# Altium project RPM_Chap.PrjPcb
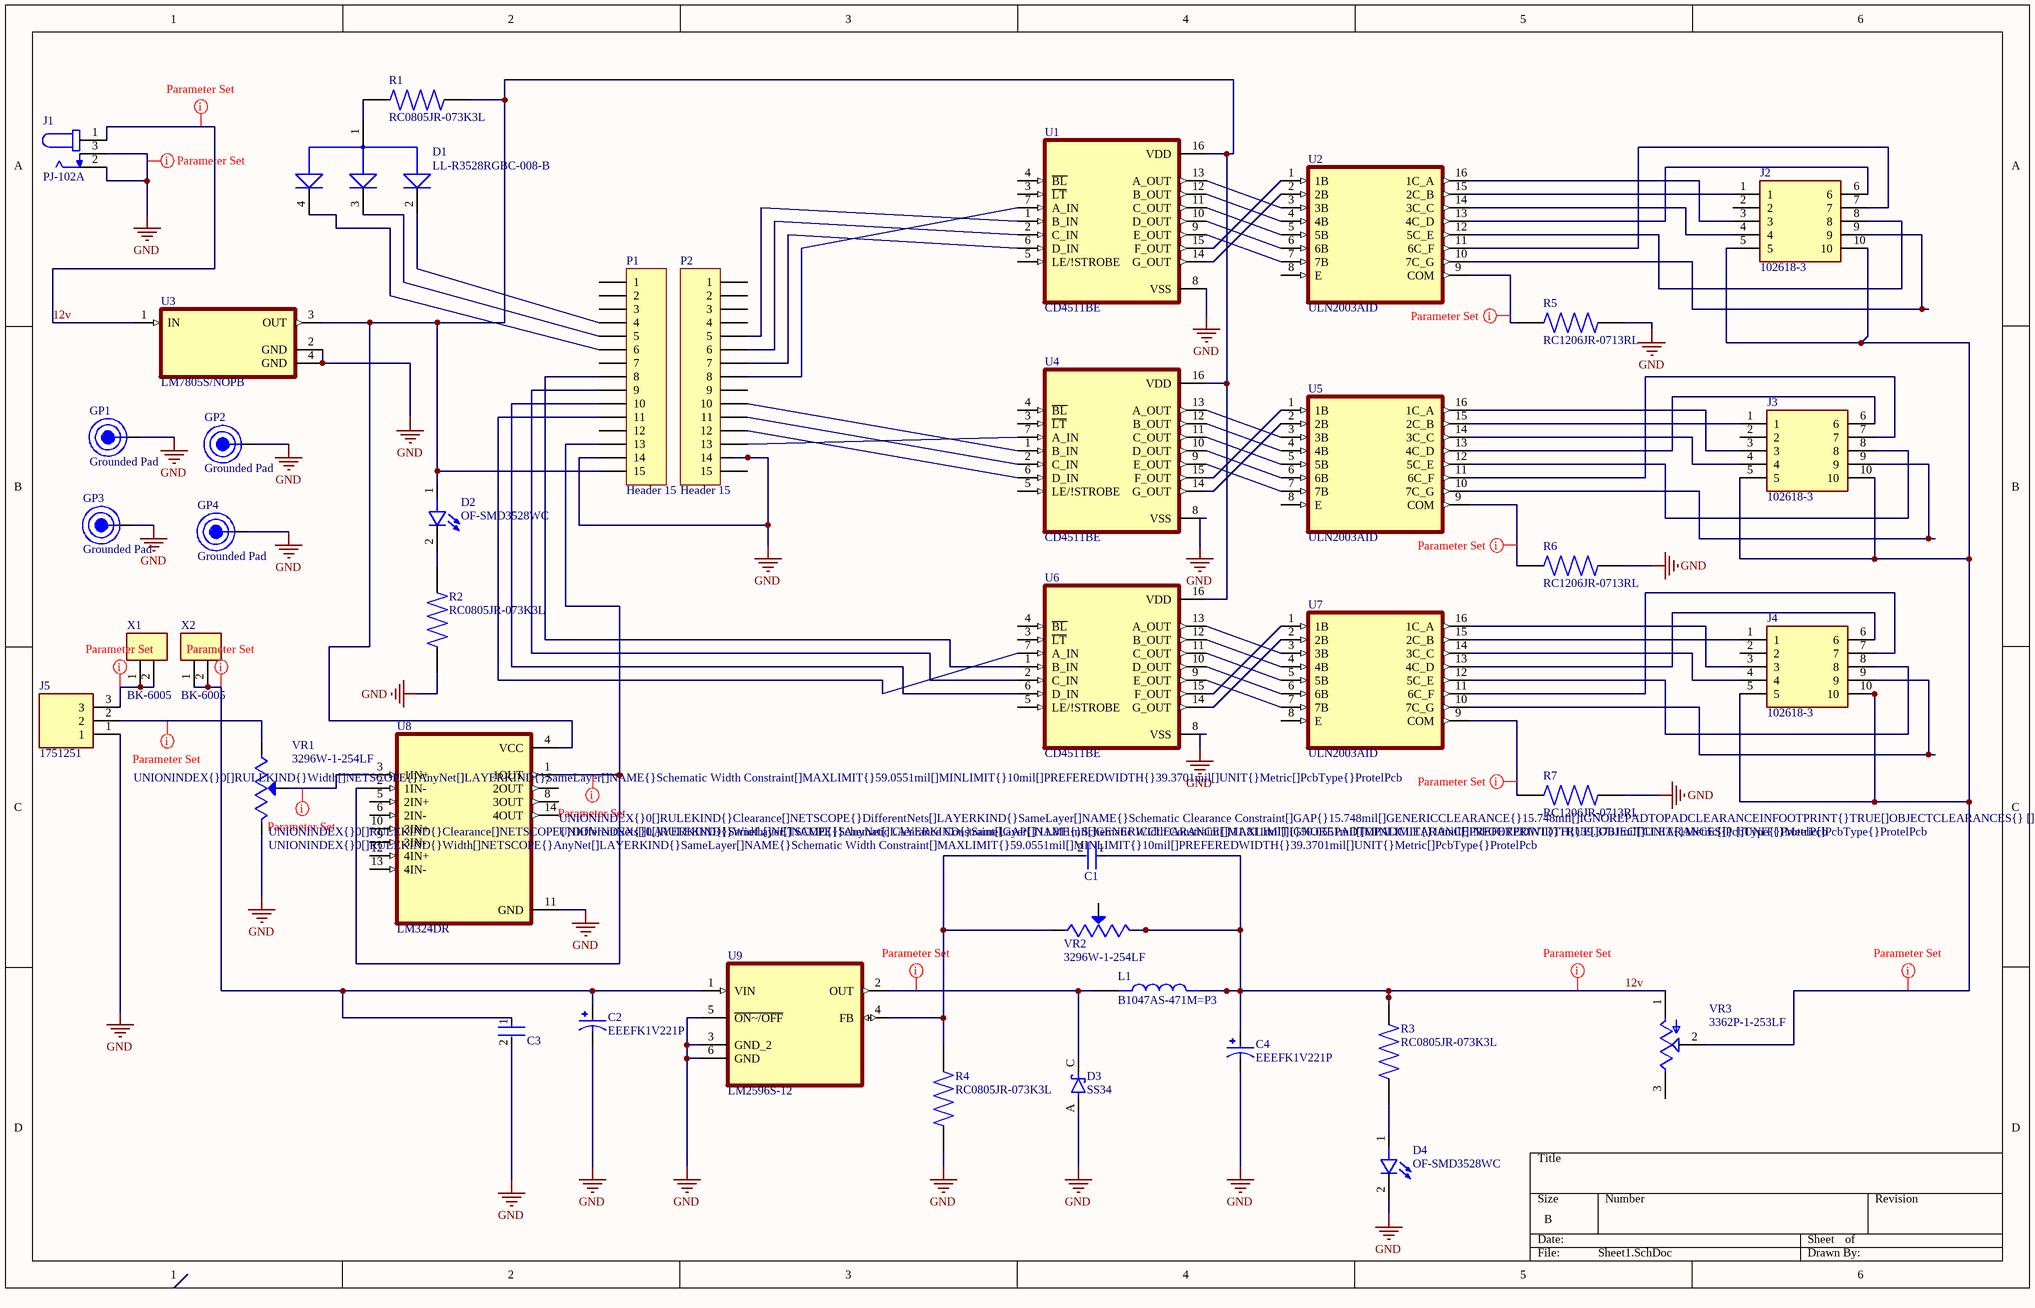
[diagram p0: Sheet1.SchDoc]
1 sheet, 41 parts. Net scope: global (net labels, ports and power ports of the same name join across sheets).
Board file: PCB1.PcbDoc

## Sheet Sheet1.SchDoc
size B

### Parts
C1  C0805C104K5RAC  [KEMET_C0805C-DN_IPC_C]  (value not drawn)
C2  EEEFK1V221P  [CAP_EEEFK1V221P]
C3  C0805C104K5RAC  [KEMET_C0805C-DN_IPC_C]  (value not drawn)
C4  EEEFK1V221P  [CAP_EEEFK1V221P]
D1  LL-R3528RGBC-008-B  [LED_LL-R3528RGBC-008-B]
D2  OF-SMD3528WC  [LED_OF-SMD3528WC]
D3  SS34  [DIOM7959X265N]
D4  OF-SMD3528WC  [LED_OF-SMD3528WC]
GP1  Grounded Pad  [2.75mm Grounded Pad]
GP2  Grounded Pad  [2.75mm Grounded Pad]
GP3  Grounded Pad  [2.75mm Grounded Pad]
GP4  Grounded Pad  [2.75mm Grounded Pad]
J1  PJ-102A  [CUI_PJ-102A]
J2  102618-3  [TE_102618-3]
J3  102618-3  [TE_102618-3]
J4  102618-3  [TE_102618-3]
J5  1751251  [PHOENIX_1751251]
L1  B1047AS-471M=P3  [IND_B1047AS-471M=P3]
P1  Header 15  [HDR1X15]
P2  Header 15  [HDR1X15]
R1  RC0805JR-073K3L  [RESC2012X60N]
R2  RC0805JR-073K3L  [RESC2012X60N]
R3  RC0805JR-073K3L  [RESC2012X60N]
R4  RC0805JR-073K3L  [RESC2012X60N]
R5  RC1206JR-0713RL  [RESC3116X65N]
R6  RC1206JR-0713RL  [RESC3116X65N]
R7  RC1206JR-0713RL  [RESC3116X65N]
U1  CD4511BE  [DIP794W45P254L1969H508Q16]
U2  ULN2003AID  [SOIC127P600X175-16N]
U3  LM7805S/NOPB  [TO254P1524X483-4N]
U4  CD4511BE  [DIP794W45P254L1969H508Q16]
U5  ULN2003AID  [SOIC127P600X175-16N]
U6  CD4511BE  [DIP794W45P254L1969H508Q16]
U7  ULN2003AID  [SOIC127P600X175-16N]
U8  LM324DR  [SOIC127P600X175-14N]
U9  LM2596S-12  [TO170P1435X465-6N]
VR1  3296W-1-254LF  [TRIM_3296W-1-254LF]
VR2  3296W-1-254LF  [TRIM_3296W-1-254LF]
VR3  3362P-1-253LF  [TRIM_3362P-1-253LF]
X1  BK-6005  [FUSE_BK-6005]
X2  BK-6005  [FUSE_BK-6005]

### Nets
GND: C2.2 C3.2 C4.2 D3.A D4.2(C) GP1.1 GP2.1 GP3.1 GP4.1 J1.2 J1.3 J5.1 P1.14 P2.14 R2.1 R4.1 R5.2 R6.2 R7.2 U1.8(VSS) U3.2(GND) U3.4(GND) U4.8(VSS) U6.8(VSS) U8.11(GND) U9.3(GND_2) U9.5(~{ON~/OFF}) U9.6(GND) VR1.3(CW)
12v: C1.1 C4.1 J1.1 L1.2 R3.2 U3.1(IN) VR2.3(CW) VR3.1(CCW)
NetC1_2: C1.2 R4.2 U9.4(FB) VR2.1(CCW)
NetC2_1: C2.1 C3.1 U9.1(VIN) X2.1 X2.2
NetD1_1: D1.1(COMM_ANODE) R1.2
NetD1_2: D1.2(CATHODE_RED) P1.4
NetD1_3: D1.3(CATHODE_GREEN) P1.5
NetD1_4: D1.4(CATHODE_BLUE) P1.6
NetD2_1: D2.1(A) P1.15 R1.1 U1.16(VDD) U3.3(OUT) U4.16(VDD) U6.16(VDD) U8.4(VCC)
NetD2_2: D2.2(C) R2.2
NetD3_C: D3.C(K) L1.1 U9.2(OUT)
NetD4_1: D4.1(A) R3.1
NetJ2_1: J2.1 U2.15(2C_B)
NetJ2_3: J2.3 U2.16(1C_A)
NetJ2_4: J2.4 U2.14(3C_C)
NetJ2_5: J2.5 J2.10 J3.5 J3.10 J4.5 J4.10 VR3.2(WIPER)
NetJ2_6: J2.6 U2.13(4C_D)
NetJ2_7: J2.7 U2.11(6C_F)
NetJ2_8: J2.8 U2.12(5C_E)
NetJ2_9: J2.9 U2.10(7C_G)
NetJ3_1: J3.1 U5.15(2C_B)
NetJ3_3: J3.3 U5.16(1C_A)
NetJ3_4: J3.4 U5.14(3C_C)
NetJ3_6: J3.6 U5.13(4C_D)
NetJ3_7: J3.7 U5.11(6C_F)
NetJ3_8: J3.8 U5.12(5C_E)
NetJ3_9: J3.9 U5.10(7C_G)
NetJ4_1: J4.1 U7.15(2C_B)
NetJ4_3: J4.3 U7.16(1C_A)
NetJ4_4: J4.4 U7.14(3C_C)
NetJ4_6: J4.6 U7.13(4C_D)
NetJ4_7: J4.7 U7.11(6C_F)
NetJ4_8: J4.8 U7.12(5C_E)
NetJ4_9: J4.9 U7.10(7C_G)
NetJ5_2: J5.2 VR1.1(CCW)
NetJ5_3: J5.3 X1.1 X1.2
NetP1_8: P1.8 U6.1(B_IN)
NetP1_9: P1.9 U6.2(C_IN)
NetP1_10: P1.10 U6.6(D_IN)
NetP1_11: P1.11 U6.7(A_IN)
NetP1_13: P1.13 U8.1(1OUT) U8.2(1IN-)
NetP2_5: P2.5 U1.1(B_IN)
NetP2_6: P2.6 U1.2(C_IN)
NetP2_7: P2.7 U1.6(D_IN)
NetP2_8: P2.8 U1.7(A_IN)
NetP2_10: P2.10 U4.1(B_IN)
NetP2_11: P2.11 U4.2(C_IN)
NetP2_12: P2.12 U4.6(D_IN)
NetP2_13: P2.13 U4.7(A_IN)
NetR5_1: R5.1 U2.9(COM)
NetR6_1: R6.1 U5.9(COM)
NetR7_1: R7.1 U7.9(COM)
NetU1_9: U1.9(E_OUT) U2.7(7B)
NetU1_10: U1.10(D_OUT) U2.6(6B)
NetU1_11: U1.11(C_OUT) U2.5(5B)
NetU1_12: U1.12(B_OUT) U2.4(4B)
NetU1_13: U1.13(A_OUT) U2.3(3B)
NetU1_14: U1.14(G_OUT) U2.2(2B)
NetU1_15: U1.15(F_OUT) U2.1(1B)
NetU4_9: U4.9(E_OUT) U5.7(7B)
NetU4_10: U4.10(D_OUT) U5.6(6B)
NetU4_11: U4.11(C_OUT) U5.5(5B)
NetU4_12: U4.12(B_OUT) U5.4(4B)
NetU4_13: U4.13(A_OUT) U5.3(3B)
NetU4_14: U4.14(G_OUT) U5.2(2B)
NetU4_15: U4.15(F_OUT) U5.1(1B)
NetU6_9: U6.9(E_OUT) U7.7(7B)
NetU6_10: U6.10(D_OUT) U7.6(6B)
NetU6_11: U6.11(C_OUT) U7.5(5B)
NetU6_12: U6.12(B_OUT) U7.4(4B)
NetU6_13: U6.13(A_OUT) U7.3(3B)
NetU6_14: U6.14(G_OUT) U7.2(2B)
NetU6_15: U6.15(F_OUT) U7.1(1B)
NetU8_3: U8.3(1IN+) VR1.2(WIPER)

Not connected (* = marked no-connect by the designer): J2 2; J3 2; J4 2; P1 1 2 3 7 12; P2 1 2 3 4 9 15; U1 3(~{LT}) 4(~{BL}) 5(LE/!STROBE); U2 8(E); U4 3(~{LT}) 4(~{BL}) 5(LE/!STROBE); U5 8(E); U6 3(~{LT}) 4(~{BL}) 5(LE/!STROBE); U7 8(E); U8 5(2IN+) 6(2IN-) 7(2OUT) 8(3OUT) 9(3IN-) 10(3IN+) 12(4IN+) 13(4IN-) 14(4OUT); VR2 2(WIPER); VR3 3(CW)

### Layout directives
rule Width Constraint [Pref Width = 1.3mm    Min Width = 1mm    Max Width = 1.5mm]: 12v, NetC2_1, NetD3_C, NetJ2_5, NetJ5_3, NetR5_1, NetR6_1, NetR7_1
rule Width Constraint [Pref Width = 1mm    Min Width = 0.254mm    Max Width = 1.5mm]: NetJ5_2
rule Clearance Constraint [Clearance = 0.3mm]; rule Width Constraint [Pref Width = 1mm    Min Width = 0.254mm    Max Width = 1.5mm]: NetU8_3
rule Clearance Constraint [Clearance = 0.4mm]; rule Width Constraint [Pref Width = 1mm    Min Width = 0.254mm    Max Width = 1.5mm]: NetP1_13
rule Clearance Constraint [Generic clearance = 10mil, and 9 value(s) for objects]: 12v, GND

### Library data of the parts
C2 C4 = EEEFK1V221P: 220ÂµF 35V Aluminum Electrolytic Capacitors Radial, Can - SMD 2000 Hrs @ 105Â°C; MF: Panasonic; Price: None; Package: RADIAL-2 Panasonic; Check_prices: https://www.snapeda.com/parts/EEEFK1V221P/Panasonic/view-part/2501925/?ref=eda; Availability: In Stock; MP: EEEFK1V221P; Value: *; SnapEDA_Link: https://www.snapeda.com/parts/EEEFK1V221P/Panasonic/view-part/2501925/?ref=snap
D1 = LL-R3528RGBC-008-B: LED; SMD; 3528, PLCC2; RGB; 3.5x2.8mm; 120Â°; Red lumin: 1; MF: Lucky Light; Package: PLCC-2 Lucky Light; Availability: Unavailable; Value: *; MP: LL-R3528RGBC-008-B; SnapEDA_Link: https://www.snapeda.com/parts/LL-R3528RGBC-008-B/Lucky%20Light/view-part/47649/?ref=snap; Price: None
D2 D4 = OF-SMD3528WC: LED; SMD; 3528, PLCC2; white cold; 1700-2500mcd; 120Â°; 2; MF: Optoflash; Package: PLCC-2 Optoflash; MP: OF-SMD3528WC; Price: None; SnapEDA_Link: https://www.snapeda.com/parts/OF-SMD3528WC/Optoflash/view-part/702333/?ref=snap; Check_prices: https://www.snapeda.com/parts/OF-SMD3528WC/Optoflash/view-part/702333/?ref=eda; Value: *; Availability: Unavailable
D3 = SS34: Diode Schottky 40V 3A Surface Mount SMC _DO-214AB_; MF: ON Semiconductor; SnapEDA_Link: https://www.snapeda.com/parts/SS34/ON%20Semiconductor/view-part/4631325/?ref=snap; MP: SS34; Availability: Unavailable; Price: None; Value: *; Package: DO-214AB-214 ON Semiconductor
GP1-GP4 = 2.75mm Grounded Pad: 2.75mm Diameter Grounded Pad
J1 = PJ-102A: 2.0 x 6.5 mm, 2.5 A, Horizontal, Through Hole, Tapered Pins, Dc Power Jack Connector; MF: CUI Devices; CUI_purchase_URL: https://www.cuidevices.com/product/interconnect/connectors/dc-power-connectors/jacks/pj-102a?utm_source=snapeda.com&utm_medium=referral&utm_campaign=snapedaBOM; Price: None; SnapEDA_Link: https://www.snapeda.com/parts/PJ-102A/CUI%20Devices/view-part/55545/?ref=snap; MP: PJ-102A; Value: *; Availability: Unavailable; Package: None
J2-J4 = 102618-3: 10 MODII HDR DRST SHRD .100CL; Package: None; Price: None; Value: *; MP: 102618-3; Availability: Unavailable
J5 = 1751251: 3 Position Wire to Board Terminal Block Horizontal with Board 0.138 _3.50mm_ Through Hole; MF: Phoenix Contact; SnapEDA_Link: https://www.snapeda.com/parts/1751251/Phoenix%20Contact/view-part/553210/?ref=snap; Value: *; MP: 1751251; Availability: Unavailable; Package: None; Price: None
L1 = B1047AS-471M=P3: Inductor Power Shielded Wirewound 220uH 20% 100KHz Ferrite 470mA 1.1Ohm DCR 2929 T/R; Package: None; Price: None; Value: *; MP: B1047AS-471M=P3; Availability: Unavailable
P1 P2 = Header 15: Header, 15-Pin; LatestRevisionDate: 17-Jul-2002; LatestRevisionNote: Re-released for DXP Platform.; Publisher: Altium Limited
R1-R4 = RC0805JR-073K3L: RC Series 0805 0.125 W 3.3 kOhms 5% Â±100 ppm/Â°C SMT Thick Film Chip Resistor; Package: None; Price: None; Value: *; MP: RC0805JR-073K3L; Availability: Unavailable
R5-R7 = RC1206JR-0713RL: 13 Ohms Â±5% 0.25W, 1/4W Chip Resistor 1206 _3216 Metric_ Moisture Resistant Thick Film; MF: Yageo; MP: RC1206JR-0713RL; Availability: Unavailable; SnapEDA_Link: https://www.snapeda.com/parts/RC1206JR-0713RL/Yageo/view-part/105893/?ref=snap; Package: 3116 Yageo; Value: *; Price: None
U1 U4 U6 = CD4511BE: CMOS BCD-to-7-Segment LED Latch Decoder Drivers 16-PDIP -55 to 125; MF: Texas Instruments; MP: CD4511BE; SnapEDA_Link: https://www.snapeda.com/parts/CD4511BE/Texas%20Instruments/view-part/586644/?ref=snap; Price: None; Purchase-URL: https://pricing.snapeda.com/search/part/CD4511BE/?ref=eda; Package: PDIP-16 Texas Instruments; Availability: Good; Check_prices: https://www.snapeda.com/parts/CD4511BE/Texas%20Instruments/view-part/586644/?ref=eda; Value: *
U2 U5 U7 = ULN2003AID: 50-V, 7-ch darlington transistor array, -40 to 105C 16-SOIC -40 to 105; MF: Texas Instruments; Check_prices: https://www.snapeda.com/parts/ULN2003AID/Texas%20Instruments/view-part/1101113/?ref=eda; SnapEDA_Link: https://www.snapeda.com/parts/ULN2003AID/Texas%20Instruments/view-part/1101113/?ref=snap; Digi-Key_Part_Number: 296-15407-2-ND; Value: *; MP: ULN2003AID; Purchase-URL: https://pricing.snapeda.com/search/part/ULN2003AID/?ref=eda; Package: SOIC-16 Texas Instruments
U3 = LM7805S/NOPB: 1.5-A, 30-V, linear voltage regulator 3-DDPAK/TO-263 0 to 125; MF: Texas Instruments; MP: LM7805S/NOPB; Value: *; SnapEDA_Link: https://www.snapeda.com/parts/LM7805S/NOPB/Texas%20Instruments/view-part/546227/?ref=snap; Price: None; Package: TO-263-3 Texas Instruments; DigiKey-Purchase-URL: https://snapeda.com/shop?store=DigiKey&id=546227; Texas_Instruments-Purchase-URL: https://snapeda.com/shop?store=Texas+Instruments&id=546227; Availability: Warning
U8 = LM324DR: 4-Channel industry standard operational amplifier 14-SOIC 0 to 70; MF: Texas Instruments; SnapEDA_Link: https://www.snapeda.com/parts/LM324DR/Texas%20Instruments/view-part/1818/?ref=snap; Arrow_Electronics-Purchase-URL: https://snapeda.com/shop?store=Arrow+Electronics&id=1818; Value: *; MP: LM324DR; Availability: Good; Texas_Instruments-Purchase-URL: https://snapeda.com/shop?store=Texas+Instruments&id=1818; DigiKey-Purchase-URL: https://snapeda.com/shop?store=DigiKey&id=1818; Package: SOIC-14 Texas Instruments; Mouser-Purchase-URL: https://snapeda.com/shop?store=Mouser&id=1818; Price: None
U9 = LM2596S-12: Buck Switching Regulator IC Positive Fixed 12V 1 Output 3A TO-263-6, DÂ²Pak _5 Leads + Tab_, TO-263BA; MF: Texas Instruments; Value: *; SnapEDA_Link: https://www.snapeda.com/parts/LM2596S-12/Texas%20Instruments/view-part/558935/?ref=snap; Price: None; Availability: Unavailable; Package: TO-263-5 Texas Instruments; MP: LM2596S-12
VR1 VR2 = 3296W-1-254LF: 250 kOhms 0.5W, 1/2W PC Pins Through Hole Trimmer Potentiometer Cermet 25 Turn Top Adjustment; MF: Bourns; SnapEDA_Link: https://www.snapeda.com/parts/3296W-1-254LF/Bourns%20-%20J.W.%20Miller/view-part/231802/?ref=snap; MP: 3296W-1-254LF; Availability: Warning; Price: None; Value: *; Check_prices: https://www.snapeda.com/parts/3296W-1-254LF/Bourns%20-%20J.W.%20Miller/view-part/231802/?ref=eda; Package: SOT-23-5 Bourns; Purchase-URL: https://pricing.snapeda.com/search/part/3296W-1-254LF/?ref=eda
VR3 = 3362P-1-253LF: 25 kOhms 0.5W, 1/2W PC Pins Through Hole Trimmer Potentiometer Cermet 1 Turn Top Adjustment; MF: Bourns; Check_prices: https://www.snapeda.com/parts/3362P-1-253LF/Bourns/view-part/493663/?ref=eda; SnapEDA_Link: https://www.snapeda.com/parts/3362P-1-253LF/Bourns/view-part/493663/?ref=snap; Availability: Good; Value: *; Purchase-URL: https://pricing.snapeda.com/search/part/3362P-1-253LF/?ref=eda; Price: None; MP: 3362P-1-253LF; Package: 3116 Bourns
X1 X2 = BK-6005: Fuse Clip 1 Circuit Cartridge Through Hole; MF: MPD; MP: BK-6005; Value: *; Package: Non-Standard MPD; Availability: Unavailable; Price: None; SnapEDA_Link: https://www.snapeda.com/parts/BK-6005/MPD/view-part/4614389/?ref=snap